# Altium schematic sheet Sheet1.SchDoc: Датчик давления
size 209 x 297 mm; Date: 1; Author: Прохоренко; Engineer: Прохоренко; DocumentNumber: 1; Revision: 1; SheetNumber: 1; SheetTotal: 1; Time: 1; ImagePath: 1; Application_BuildNumber: Плата датчика давления
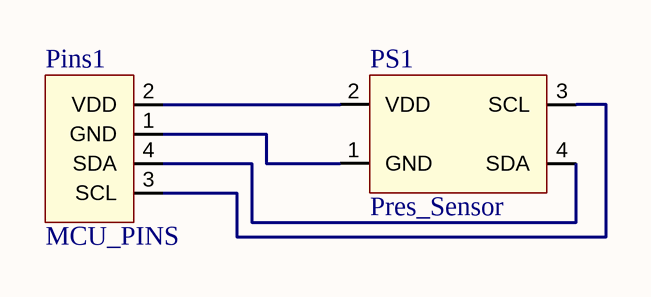
[diagram p0: Sheet1.SchDoc]

## Parts
Pins1  MCU_PINS  [PIN_ROW]
PS1  Pres_Sensor  [Pressure_Footprint]

## Nets
NetPins1_1: Pins1.1(GND) PS1.1(GND)
NetPins1_2: Pins1.2(VDD) PS1.2(VDD)
NetPins1_3: Pins1.3(SCL) PS1.3(SCL)
NetPins1_4: Pins1.4(SDA) PS1.4(SDA)

## Notes on the sheet
- Перв.примен.
- Справ.№
- Подп. и дата
- Инв.№ дубл.
- Взам.инв.№
- Подп.и дата
- Разраб.
- Изм.
- Лист
- № докум.
- Подп.
- Дата
- Лит.
- Масштаб
- Масса
- Т.контр.
- Пров.
- СХЕМА   ЭЛЕКТРИЧЕСКАЯ
- ПРИНЦИПИАЛЬНАЯ
- Листов
- Инв.№ подл.
- Утв.
- Н.контр.
- Нач.сект.
- Копировал
- Формат  A3